# EAGLE schematic PCB_Draft_0 (EAGLE 9.6.2)
AUTHOR: R. Hall, A. Singh, K.Quizon; BOARD_NAME: ESP32 I2C Exp / M Driver; DOC_NUM: 0; PROJECT_NAME: R8-O7 PCB; REVISION: 3
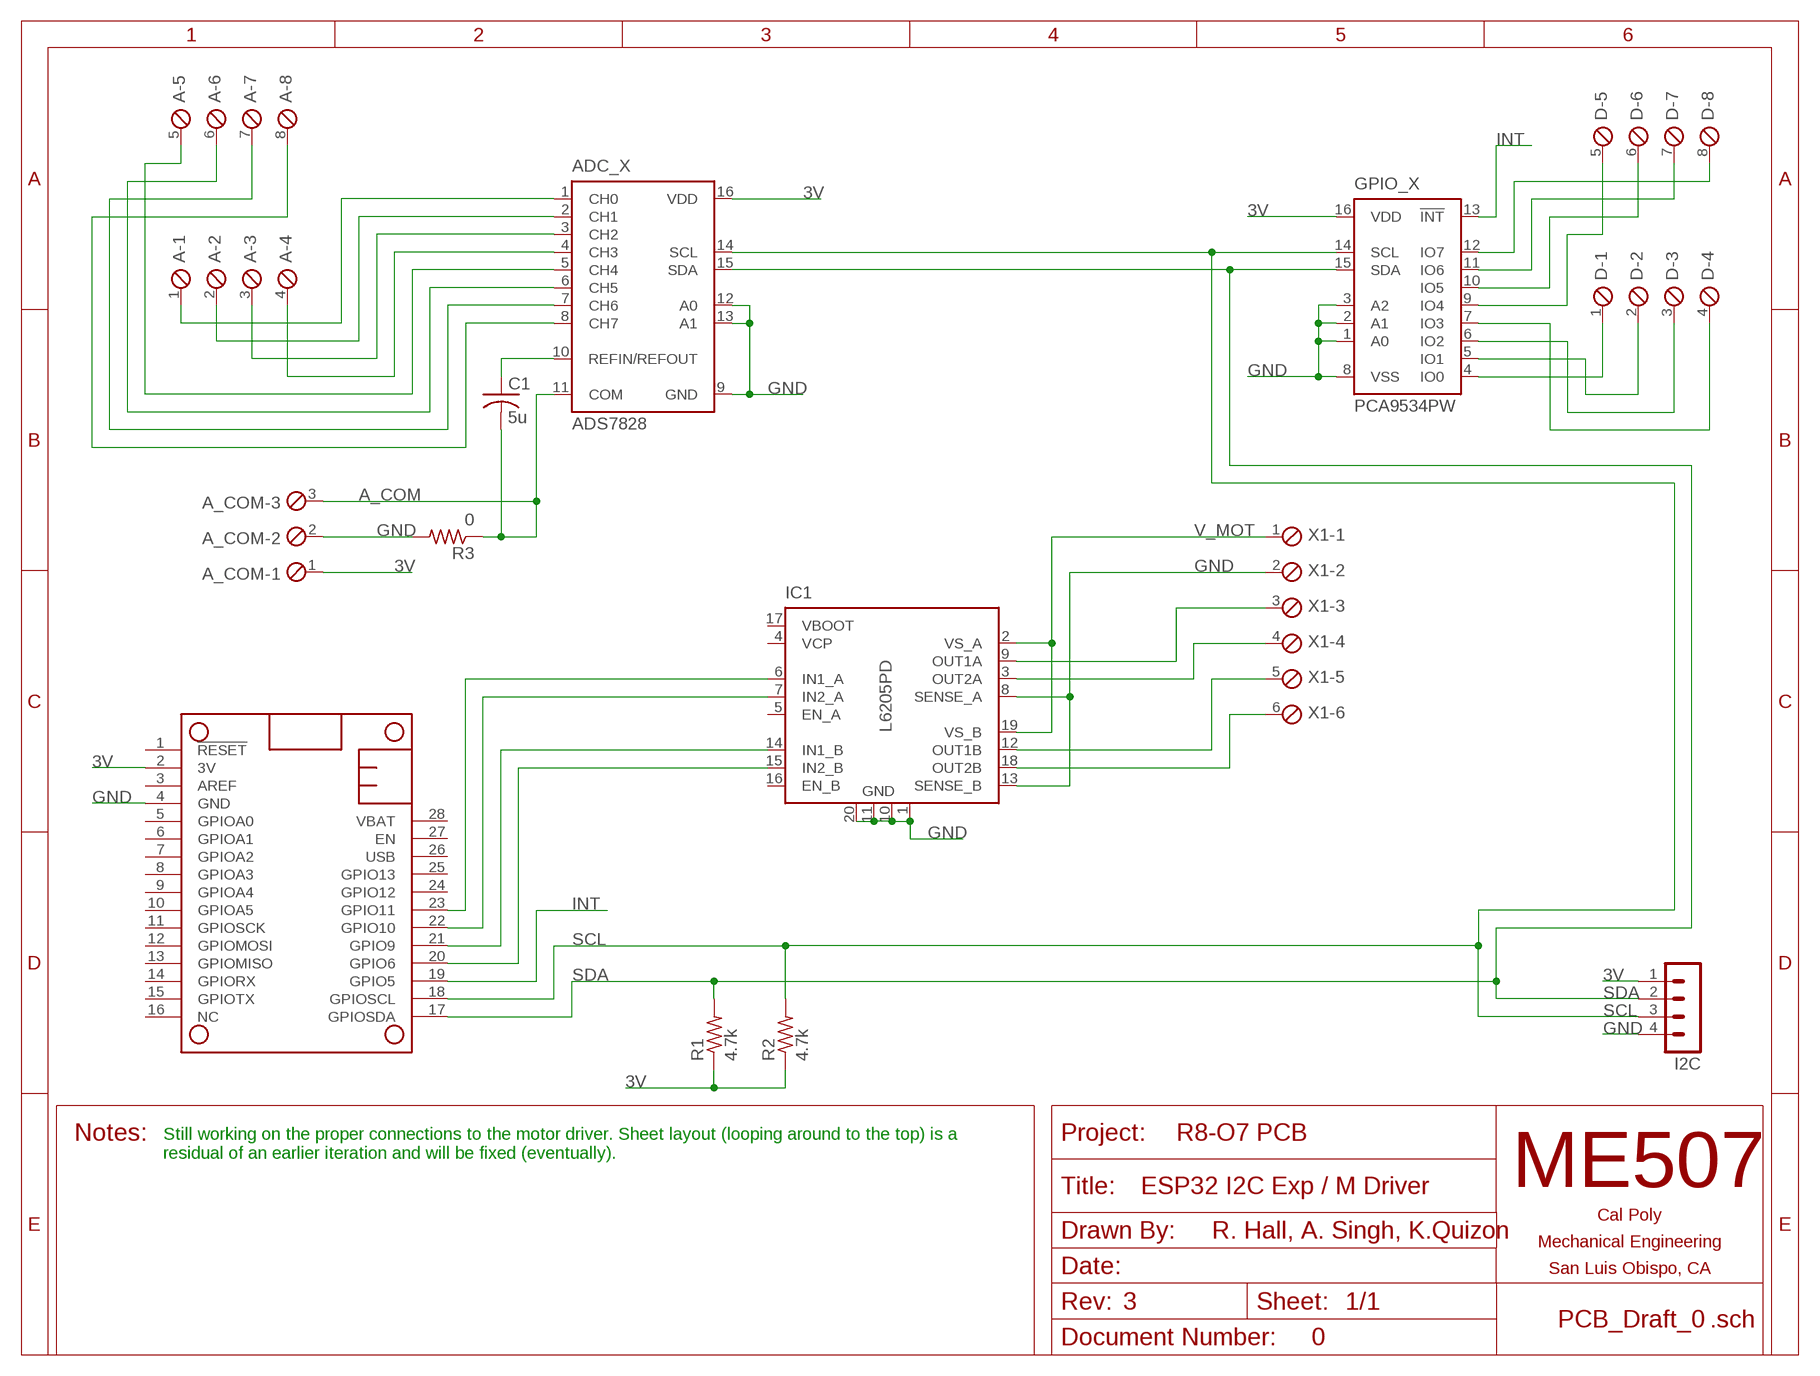
[diagram p0: schematic, sheet 1]

## Parts
A  SCREWTERM_8P_254  [8POL254]
A_COM  SCREWTERM_3P_254  [3POL254]
ADC_X  ADS7828  [TSSOP16-PW]
C1  5u  C-USC0805  [C0805]
D  SCREWTERM_8P_254  [8POL254]
GPIO_X  PCA9534PW  [TSSOP16]
I2C  MA04-1  [MA04-1]
IC1  L6205PD  [POWERSO-20]
MS1  FEATHERWINGEXTENDED_BOTH_ENDS  [FEATHERWING]
R1  4.7k  R-US_R0805  [R0805]
R2  4.7k  R-US_R0805  [R0805]
R3  0  R-US_M0805  [M0805]
X1  SCREWTERM_6P_254  [6POL254]

## Nets
3V: A_COM.1 ADC_X.16(VDD) GPIO_X.16(VDD) I2C.1 MS1.2(3V) R1.1 R2.1
A_COM: A_COM.3 ADC_X.11(COM) C1.2 R3.1
GND: A_COM.2 ADC_X.9(GND) ADC_X.12(A0) ADC_X.13(A1) GPIO_X.1(A0) GPIO_X.2(A1) GPIO_X.3(A2) GPIO_X.8(VSS) I2C.4 IC1.1(GND) IC1.8(SENSE_A) IC1.10(GND) IC1.11(GND) IC1.13(SENSE_B) IC1.20(GND) MS1.4(GND) R3.2 X1.2
INT: GPIO_X.13(!INT) MS1.19(GPIO5)
N$1: D.1 GPIO_X.4(IO0)
N$2: D.2 GPIO_X.5(IO1)
N$3: D.3 GPIO_X.6(IO2)
N$4: D.4 GPIO_X.7(IO3)
N$5: D.5 GPIO_X.9(IO4)
N$6: D.6 GPIO_X.10(IO5)
N$7: D.7 GPIO_X.11(IO6)
N$8: D.8 GPIO_X.12(IO7)
N$9: A.1 ADC_X.1(CH0)
N$10: A.2 ADC_X.2(CH1)
N$11: A.3 ADC_X.3(CH2)
N$12: A.4 ADC_X.4(CH3)
N$13: A.5 ADC_X.5(CH4)
N$14: A.6 ADC_X.6(CH5)
N$15: A.7 ADC_X.7(CH6)
N$16: A.8 ADC_X.8(CH7)
N$17: ADC_X.10(REFIN/REFOUT) C1.1
N$18: IC1.9(OUT1A) X1.3
N$19: IC1.3(OUT2A) X1.4
N$20: IC1.12(OUT1B) X1.5
N$21: IC1.18(OUT2B) X1.6
N$22: IC1.6(IN1_A) MS1.23(GPIO11)
N$24: IC1.15(IN2_B) MS1.20(GPIO6)
N$25: IC1.14(IN1_B) MS1.21(GPIO9)
N$26: IC1.7(IN2_A) MS1.22(GPIO10)
SCL: ADC_X.14(SCL) GPIO_X.14(SCL) I2C.3 MS1.18(GPIOSCL) R2.2
SDA: ADC_X.15(SDA) GPIO_X.15(SDA) I2C.2 MS1.17(GPIOSDA) R1.2
V_MOT: IC1.2(VS_A) IC1.19(VS_B) X1.1
Unconnected: IC1.5(EN_A) IC1.16(EN_B) MS1.1(!RESET) MS1.3(AREF) MS1.5(GPIOA0) MS1.6(GPIOA1) MS1.7(GPIOA2) MS1.8(GPIOA3) MS1.9(GPIOA4) MS1.10(GPIOA5) MS1.11(GPIOSCK) MS1.12(GPIOMOSI) MS1.13(GPIOMISO) MS1.14(GPIORX) MS1.15(GPIOTX) MS1.16(NC) MS1.24(GPIO12) MS1.25(GPIO13) MS1.26(USB) MS1.27(EN) MS1.28(VBAT)

## Notes on the sheet
- Still working on the proper connections to the motor driver. Sheet layout (looping around to the top) is a 
  residual of an earlier iteration and will be fixed (eventually).

## Power pins joined to a net without a drawn wire
VBOOT: IC1.17(VBOOT)
VCP: IC1.4(VCP)

## Library data of the parts
A D = ME507:SCREWTERM_8P: Screw Terminal Block This part is designed for a screw terminal connector. The 2.54mm (0.100 inch) foorprint can also be used for male or female pin headers such as those on most development boards. One can also solder wires directly into the holes, though this makes modifications or repairs to the system more inconvenient. Larger versions can carry more current.
A_COM = ME507:SCREWTERM_3P: Screw Terminal Block This part is designed for a screw terminal connector. The 2.54mm (0.100 inch) foorprint can also be used for male or female pin headers such as those on most development boards. One can also solder wires directly into the holes, though this makes modifications or repairs to the system more inconvenient. Larger versions can carry more current.
ADC_X = burr-brown:ADS7828: 12-Bit, 8-Channel Sampling ANALOG-TO-DIGITAL CONVERTER with I2C? Interface Source: www.ti.com .. ADS7828.pdf; MF: TEXAS INSTRUMENTS; MPN: ADS7828E/250; OC_FARNELL: 1470338; OC_NEWARK: 74C7158
C1 = rcl:C-US: CAPACITOR, American symbol; SPICEPREFIX: C
GPIO_X = micro-philips:PCA9534: 8-bit I2C-bus and SMBus low power I/O port with interrupt Source: www.nxp.com .. PCA9534_3.pdf; MPN: PCA9534PW; OC_FARNELL: 1408285; OC_NEWARK: 18M7516
I2C = con-lstb:MA04-1: PIN HEADER; OC_FARNELL: unknown; OC_NEWARK: unknown
IC1 = st-microelectronics:L6205: DUAL DMOS FULL BRIDGE MOTOR DRIVER; MF: Arrow Electronics; MPN: L6205PD; OC_FARNELL: unknown; OC_NEWARK: 89K0755
MS1 = ME507:FEATHERWING: AdaFruitTM Feather Wing A modified version of a Featherwing, the add-on board for an AdaFruit(tm) Feather development board. There is a standard size version which is the same size as the Feather board on which the microcontroller hangs out. There is also an extended version, with each and longer by a quarter inch to allow for connectors such as screw terminals which aren't hidden under another board if this wing isn't on the top of the board stack. The pins are named in a generic fashion; these names do not necessarily correspond to Arduino or Python pin numbers. The designer must refer to the pinout diagram for each specific Feather board to find the functions of each pin.
R1-R3 = rcl:R-US_: RESISTOR, American symbol; SPICEPREFIX: R
X1 = ME507:SCREWTERM_6P: Screw Terminal Block This part is designed for a screw terminal connector. The 2.54mm (0.100 inch) foorprint can also be used for male or female pin headers such as those on most development boards. One can also solder wires directly into the holes, though this makes modifications or repairs to the system more inconvenient. Larger versions can carry more current.